# Altium project BEAGLEBONEBLACK_REV A5B.PrjPcb (part 4 of 5)

## Sheet P07_DDR3 Memory.SchDoc
size 386 x 246 mm
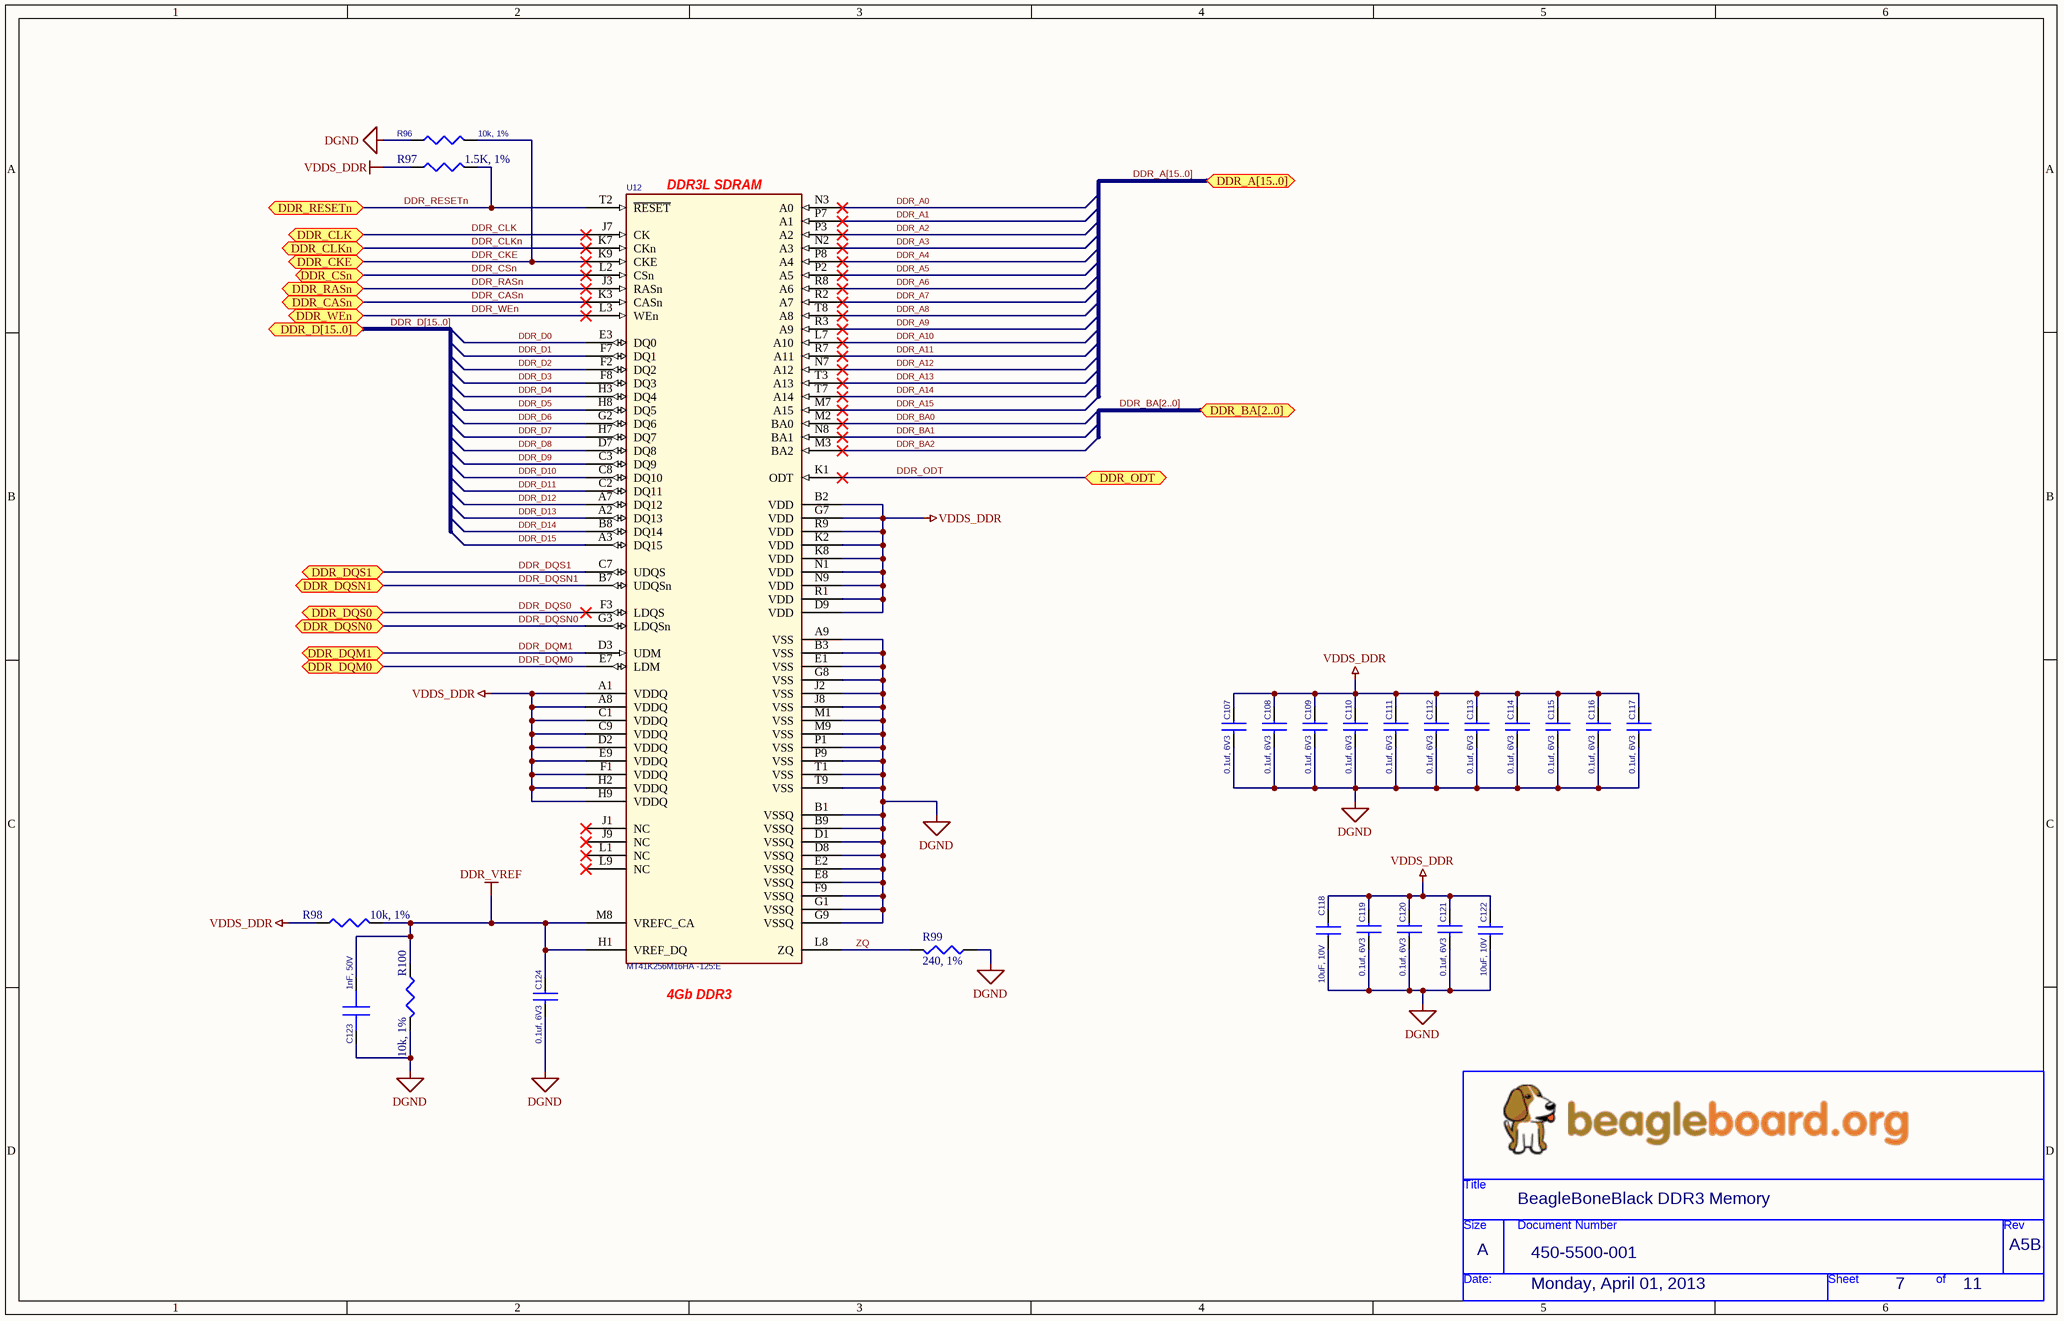
[diagram p8: P07_DDR3 Memory.SchDoc]

### Parts
(Parts that share a designator on the sheet are numbered #1, #2 ... from top to bottom, then left to right.)
*#7  Page Create Date: Monday, April 01, 2013  Doc: 450-5500-001  RevCode: A5B  Title: BeagleBoneBlack DDR3 Memory  Page Size: A  Page Number: 7  Page Count: 11  (hidden comment: BeagleBoard_org)  (graphical)
C107  0.1uf, 6V3  [402]
C108  0.1uf, 6V3  [402]
C109  0.1uf, 6V3  [402]
C110  0.1uf, 6V3  [402]
C111  0.1uf, 6V3  [402]
C112  0.1uf, 6V3  [402]
C113  0.1uf, 6V3  [402]
C114  0.1uf, 6V3  [402]
C115  0.1uf, 6V3  [402]
C116  0.1uf, 6V3  [402]
C117  0.1uf, 6V3  [402]
C118  10uF, 10V  [805]
C119  0.1uf, 6V3  [402]
C120  0.1uf, 6V3  [402]
C121  0.1uf, 6V3  [402]
C122  10uF, 10V  [805]
C123  1nF, 50V  [402]
C124  0.1uf, 6V3  [402]
R96  10k, 1%  [402]
R97  1.5K, 1%  [402]
R98  10k, 1%  [402]
R99  240, 1%  [402]
R100  10k, 1%  [402]
U12  MT41K256M16HA -125:E  [BGA96_T9_P8_9X14]

### Ports
DDR_A[15..0], DDR_BA[2..0], DDR_CASn, DDR_CKE, DDR_CLK, DDR_CLKn, DDR_CSn, DDR_D[15..0], DDR_DQM0, DDR_DQM1, DDR_DQS0, DDR_DQS1, DDR_DQSN0, DDR_DQSN1, DDR_ODT, DDR_RASn, DDR_RESETn, DDR_WEn

### Nets
DDR_VREF: C123.1 C124.1 R98.2 R100.1 U12.H1(VREF_DQ) U12.M8(VREFC_CA)
DGND: C107.2 C108.2 C109.2 C110.2 C111.2 C112.2 C113.2 C114.2 C115.2 C116.2 C117.2 C118.1 C119.2 C120.2 C121.2 C122.1 C123.2 C124.2 R96.1 R99.1 R100.2 U12.A9(VSS) U12.B1(VSSQ) U12.B3(VSS) U12.B9(VSSQ) U12.D1(VSSQ) U12.D8(VSSQ) U12.E1(VSS) U12.E2(VSSQ) U12.E8(VSSQ) U12.F9(VSSQ) U12.G1(VSSQ) U12.G8(VSS) U12.G9(VSSQ) U12.J2(VSS) U12.J8(VSS) U12.M1(VSS) U12.M9(VSS) U12.P1(VSS) U12.P9(VSS) U12.T1(VSS) U12.T9(VSS)
VDDS_DDR: C107.1 C108.1 C109.1 C110.1 C111.1 C112.1 C113.1 C114.1 C115.1 C116.1 C117.1 C118.2 C119.1 C120.1 C121.1 C122.2 R97.1 R98.1 U12.A1(VDDQ) U12.A8(VDDQ) U12.B2(VDD) U12.C1(VDDQ) U12.C9(VDDQ) U12.D2(VDDQ) U12.D9(VDD) U12.E9(VDDQ) U12.F1(VDDQ) U12.G7(VDD) U12.H2(VDDQ) U12.H9(VDDQ) U12.K2(VDD) U12.K8(VDD) U12.N1(VDD) U12.N9(VDD) U12.R1(VDD) U12.R9(VDD)
DDR_A0: U12.N3(A0)
DDR_A1: U12.P7(A1)
DDR_A2: U12.P3(A2)
DDR_A3: U12.N2(A3)
DDR_A4: U12.P8(A4)
DDR_A5: U12.P2(A5)
DDR_A6: U12.R8(A6)
DDR_A7: U12.R2(A7)
DDR_A8: U12.T8(A8)
DDR_A9: U12.R3(A9)
DDR_A10: U12.L7(A10)
DDR_A11: U12.R7(A11)
DDR_A12: U12.N7(A12)
DDR_A13: U12.T3(A13)
DDR_A14: U12.T7(A14)
DDR_A15: U12.M7(A15)
DDR_BA0: U12.M2(BA0)
DDR_BA1: U12.N8(BA1)
DDR_BA2: U12.M3(BA2)
DDR_CASn: U12.K3(CASn) ; port DDR_CASn
DDR_CKE: R96.2 U12.K9(CKE) ; port DDR_CKE
DDR_CLK: U12.J7(CK) ; port DDR_CLK
DDR_CLKn: U12.K7(CKn) ; port DDR_CLKn
DDR_CSn: U12.L2(CSn) ; port DDR_CSn
DDR_D0: U12.E3(DQ0)
DDR_D1: U12.F7(DQ1)
DDR_D2: U12.F2(DQ2)
DDR_D3: U12.F8(DQ3)
DDR_D4: U12.H3(DQ4)
DDR_D5: U12.H8(DQ5)
DDR_D6: U12.G2(DQ6)
DDR_D7: U12.H7(DQ7)
DDR_D8: U12.D7(DQ8)
DDR_D9: U12.C3(DQ9)
DDR_D10: U12.C8(DQ10)
DDR_D11: U12.C2(DQ11)
DDR_D12: U12.A7(DQ12)
DDR_D13: U12.A2(DQ13)
DDR_D14: U12.B8(DQ14)
DDR_D15: U12.A3(DQ15)
DDR_DQM0: U12.E7(LDM) ; port DDR_DQM0
DDR_DQM1: U12.D3(UDM) ; port DDR_DQM1
DDR_DQS0: U12.F3(LDQS) ; port DDR_DQS0
DDR_DQS1: U12.C7(UDQS) ; port DDR_DQS1
DDR_DQSN0: U12.G3(LDQSn) ; port DDR_DQSN0
DDR_DQSN1: U12.B7(UDQSn) ; port DDR_DQSN1
DDR_ODT: U12.K1(ODT) ; port DDR_ODT
DDR_RASn: U12.J3(RASn) ; port DDR_RASn
DDR_RESETn: R97.2 U12.T2(~{RESET}) ; port DDR_RESETn
DDR_WEn: U12.L3(WEn) ; port DDR_WEn
ZQ: R99.2 U12.L8(ZQ)

Not connected (* = marked no-connect by the designer): U12 J1(NC)* J9(NC)* L1(NC)* L9(NC)*

### Buses and harness runs
bus DDR_A[15..0] = port DDR_A[15..0]
bus DDR_BA[2..0] = port DDR_BA[2..0]
bus DDR_D[15..0] = port DDR_D[15..0]

### Notes on the sheet
- (near U12) DDR3L SDRAM
- (near U12) 4Gb DDR3
- (in symbol BeagleBoard_org) Title; Size; Document Number; Rev; Date:; Sheet; of

### Library data of the parts
C107-C117 C119-C121 C124 = CAP_0.01uf_X7R_16V_10%_0402: CAP CER 0.1UF 6.3V 10% X5R 0402; Manufacturer: TDK Corporation; Manufacturer Part Number: C1005X5R0J104K050BA; Capacitance: 0.1µF; Supplier 1: Digi-Key; Supplier Part Number 1: 445-1266-6-ND; RoHS: RoHS Compliant; Category: Capacitors; Stock 1: 127604; Pricing 1: 1=0.1, 10=0.026, 100=0.0121, 250=0.00992, 500=0.00848, 1000=0.0066, 5000=0.0055 (USD); Voltage - Rated: 6.3V; Tolerance: ±10%; Temperature Coefficient: X5R; Mounting Type: Surface Mount, MLCC; Operating Temperature: -55°C ~ 85°C; Applications: General Purpose; Ratings: -; Package / Case: 0402 (1005 Metric); Size / Dimension: 0.039" L x 0.020" W (1.00mm x 0.50mm); Height - Seated (Max): -; Thickness (Max): 0.022" (0.55mm); Lead Spacing: -; Features: -; Packaging: Digi-Reel®; Lead Style: -; ComponentLink1URL: http://www.kemet.com/datasheets&C0402C104K4RACTU; ComponentLink1Description: http://www.kemet.com/datasheets&C0402C104K4RACTU
C118 C122 = CAP_4.7uF_X5R_6.3V_10%_0603: CAP CER 10UF 10V Y5V 0805; Manufacturer: TDK Corporation; Manufacturer Part Number: C2012Y5V1A106Z; Capacitance: 10µF; Tolerance: -20%, +80%; Temperature Coefficient: Y5V (F); Supplier 1: Digi-Key; Supplier Part Number 1: 445-1371-6-ND; RoHS: RoHS Compliant; Category: Capacitors; Stock 1: 102071; Pricing 1: 1=0.15, 10=0.105, 100=0.0499, 250=0.042, 500=0.03518, 1000=0.02887 (USD); Voltage - Rated: 10V; Mounting Type: Surface Mount, MLCC; Operating Temperature: -30°C ~ 85°C; Applications: General Purpose; Ratings: -; Package / Case: 0805 (2012 Metric); Size / Dimension: 0.079" L x 0.049" W (2.00mm x 1.25mm); Height - Seated (Max): -; Thickness (Max): 0.057" (1.45mm); Lead Spacing: -; Features: -; Packaging: Digi-Reel®; Lead Style: -; ComponentLink1URL: http://media.digikey.com/pdf/Data%20Sheets/TDK%20PDFs/C_Series_GeneralAppl_B11.pdf; ComponentLink1Description: http://media.digikey.com/pdf/Data%20Sheets/TDK%20PDFs/C_Series_GeneralAppl_B11.pdf
C123 = CAP SMD: CAP CER 1000PF 16V 10% X7R 0402; Manufacturer: Yageo; Manufacturer Part Number: CC0402KRX7R7BB102; Supplier 1: Digi-Key; Supplier Part Number 1: 311-1352-6-ND; RoHS: RoHS Compliant; Category: Capacitors; Stock 1: 391222; Pricing 1: 1=0.1, 10=0.012, 25=0.0088, 100=0.0057, 250=0.00464, 500=0.00396, 1000=0.00309, 2500=0.00278, 5000=0.00258 (USD); Capacitance: 1000pF; Voltage - Rated: 16V; Tolerance: ±10%; Temperature Coefficient: X7R; Mounting Type: Surface Mount, MLCC; Operating Temperature: -55°C ~ 125°C; Applications: General Purpose; Ratings: -; Package / Case: 0402 (1005 Metric); Size / Dimension: 0.039" L x 0.020" W (1.00mm x 0.50mm); Height - Seated (Max): -; Thickness (Max): 0.022" (0.55mm); Lead Spacing: -; Features: -; Packaging: Digi-Reel®; Lead Style: -; ComponentLink1URL: http://www.yageo.com/documents/recent/UPY-GPHC_X7R_6.3V-to-50V_8.pdf; ComponentLink1Description: http://www.yageo.com/documents/recent/UPY-GPHC_X7R_6.3V-to-50V_8.pdf
R96 R98 R100 = RES_10K_1/16W_1%_0402: RES 10K OHM 1/16W 5% 0402 SMD; Manufacturer: Rohm Semiconductor; Manufacturer Part Number: MCR01MZPJ103; Power (Watts): 0.063W, 1/16W; Temperature Coefficient: ±200ppm/°C; Category: Resistors; ComponentLink1Description: http://rohmfs.rohm.com/en/products/databook/datasheet/passive/resistor/chip_resistor/mcr_a.pdf; ComponentLink1URL: http://rohmfs.rohm.com/en/products/databook/datasheet/passive/resistor/chip_resistor/mcr_a.pdf; Composition: Thick Film; Features: Automotive AEC-Q200 Qualified; Height: 0.016" (0.40mm); Number of Terminations: 2; Package / Case: 0402 (1005 Metric); Packaging: Digi-Reel®; Pricing 1: 1=0.1, 10=0.019, 25=0.014, 100=0.0078, 250=0.00596, 500=0.00476, 1000=0.0035, 5000=0.00251 (USD); Resistance (Ohms): 10k; RoHS: RoHS Compliant; Size / Dimension: 0.039" L x 0.020" W (1.00mm x 0.50mm); Stock 1: 110842; Supplier 1: Digi-Key; Supplier Device Package: 0402 (1005 Metric); Supplier Part Number 1: RHM10KJDKR-ND; Tolerance: ±5%
R97 = RES_10K_1/16W_1%_0402: RES 1.50K OHM 1/16W 1% 0402 SMD; Manufacturer: Yageo; Manufacturer Part Number: RC0402FR-071K5L; Power (Watts): 0.063W, 1/16W; Temperature Coefficient: ±100ppm/°C; Supplier 1: Digi-Key; Supplier Part Number 1: 311-1.50KLRDKR-ND; RoHS: RoHS Compliant; Category: Resistors; Stock 1: 433921; Pricing 1: 1=0.1, 10=0.014, 25=0.0104, 100=0.0063, 250=0.0054, 500=0.00382, 1000=0.0027, 2500=0.00234, 5000=0.00203 (USD); Resistance (Ohms): 1.5k; Composition: Thick Film; Features: -; Tolerance: ±1%; Package / Case: 0402 (1005 Metric); Supplier Device Package: 0402; Size / Dimension: 0.039" L x 0.020" W (1.00mm x 0.50mm); Height: 0.016" (0.40mm); Number of Terminations: 2; Packaging: Digi-Reel®; ComponentLink1URL: http://www.yageo.com/documents/recent/PYu-RC0402_51_RoHS_L_6.pdf; ComponentLink1Description: http://www.yageo.com/documents/recent/PYu-RC0402_51_RoHS_L_6.pdf
R99 = RES_10K_1/16W_1%_0402: RES 240 OHM 1/10W 5% 0402 SMD; Manufacturer: Yageo; Manufacturer Part Number: RC0402FR-07240RL; Resistance (Ohms): 240; Power (Watts): 0.063W, 1/16W; Temperature Coefficient: ±100ppm/°C; Supplier 1: Digi-Key; Supplier Part Number 1: 311-240LRDKR-ND; RoHS: RoHS Compliant; Category: Resistors; Stock 1: 39100; Pricing 1: 1=0.1, 10=0.014, 25=0.0104, 100=0.0063, 250=0.0054, 500=0.00382, 1000=0.0027, 2500=0.00234, 5000=0.00203 (USD); Composition: Thick Film; Features: -; Tolerance: ±1%; Package / Case: 0402 (1005 Metric); Supplier Device Package: 0402; Size / Dimension: 0.039" L x 0.020" W (1.00mm x 0.50mm); Height: 0.016" (0.40mm); Number of Terminations: 2; Packaging: Digi-Reel®; ComponentLink1URL: http://www.yageo.com/documents/recent/PYu-RC0402_51_RoHS_L_6.pdf; ComponentLink1Description: http://www.yageo.com/documents/recent/PYu-RC0402_51_RoHS_L_6.pdf
U12 = MT41K256M16HA: DDR2 SDRAM 2Gb (256Mx8); Manufacturer: Micron Technology; Lead Time: 0 weeks; Peak Solder Temperature: 260 deg C; Supplier 1: Arrow; Supplier Part Number 1: 52128708S9959891N2406; Manufacturer Part Number: MT41K256M16HA-125:E; RoHS: CHINA ROHS: Compliant / EU ROHS: Compliant; Stock 1: 0; Pricing 1: 0=10.09 (USD); Package Quantity: 1; Termination Finish: Sn/Ag/Cu; China ROHS Lead (X -> above / O -> below threshold): O; China ROHS Mercury (X -> above / O -> below threshold): O; China ROHS Cadmium (X -> above / O -> below threshold): O; China ROHS Hex Chromium (X -> above / O -> below threshold): O; China ROHS PBB (X -> above / O -> below threshold): O; China ROHS PBDE (X -> above / O -> below threshold): O; EU_ROHS_PROD_EXEMPTION_BY_SUPP: N/R; ComponentLink1URL: http://components.arrow.com/partservice/dataview/altium/52128708S9959891N2406?apiKey=aa438727d59eed98c4bed826d8d949c84cb5e685b92bf87346a0226bd2658797; ComponentLink1Description: http://components.arrow.com/partservice/dataview/altium/52128708S9959891N2406?apiKey=aa438727d59eed98c4bed826d8d949c84cb5e685b92bf87346a0226bd2658797

## Sheet P08_eMMC.SchDoc
size 386 x 246 mm
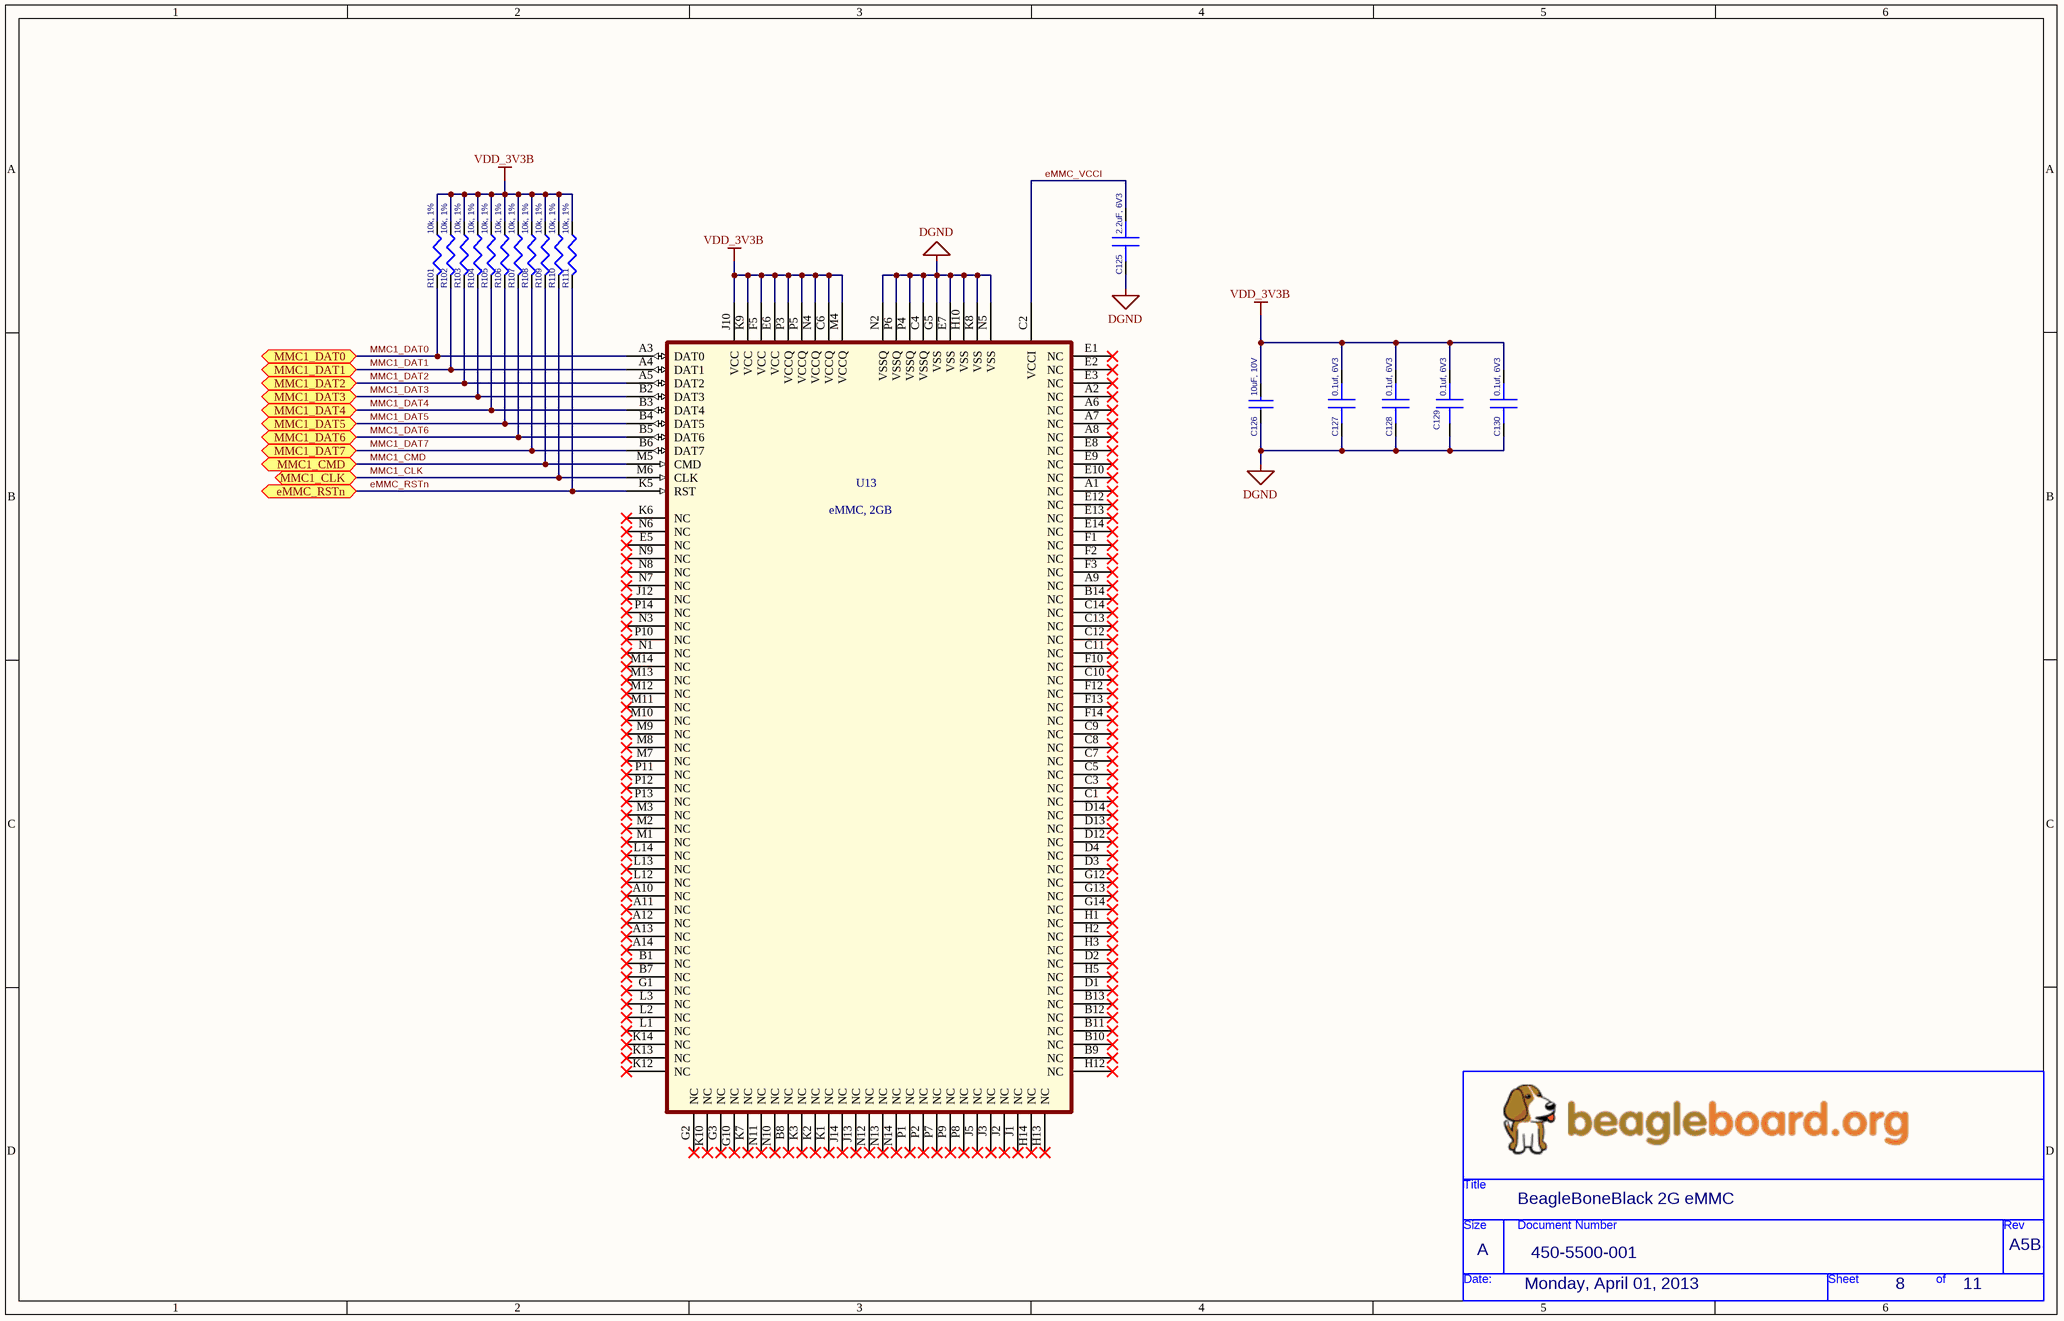
[diagram p9: P08_eMMC.SchDoc]

### Parts
(Parts that share a designator on the sheet are numbered #1, #2 ... from top to bottom, then left to right.)
*#8  Page Create Date: Monday, April 01, 2013  Doc: 450-5500-001  RevCode: A5B  Title: BeagleBoneBlack 2G eMMC  Page Size: A  Page Number: 8  Page Count: 11  (hidden comment: BeagleBoard_org)  (graphical)
C125  2.2uF, 6V3  [402]
C126  10uF, 10V  [805]
C127  0.1uf, 6V3  [402]
C128  0.1uf, 6V3  [402]
C129  0.1uf, 6V3  [402]
C130  0.1uf, 6V3  [402]
R101  10k, 1%  [402]
R102  10k, 1%  [402]
R103  10k, 1%  [402]
R104  10k, 1%  [402]
R105  10k, 1%  [402]
R106  10k, 1%  [402]
R107  10k, 1%  [402]
R108  10k, 1%  [402]
R109  10k, 1%  [402]
R110  10k, 1%  [402]
R111  10k, 1%  [402]
U13  eMMC, 2GB  [BGA153_P14_P5_11P5X13]

### Ports
eMMC_RSTn, MMC1_CLK, MMC1_CMD, MMC1_DAT0, MMC1_DAT1, MMC1_DAT2, MMC1_DAT3, MMC1_DAT4, MMC1_DAT5, MMC1_DAT6, MMC1_DAT7

### Nets
DGND: C125.2 C126.1 C127.2 C128.2 C129.2 C130.2 U13.C4(VSSQ) U13.E7(VSS) U13.G5(VSS) U13.H10(VSS) U13.K8(VSS) U13.N2(VSSQ) U13.N5(VSS) U13.P4(VSSQ) U13.P6(VSSQ)
VDD_3V3B: C126.2 C127.1 C128.1 C129.1 C130.1 R101.1 R102.1 R103.1 R104.1 R105.1 R106.1 R107.1 R108.1 R109.1 R110.1 R111.1 U13.C6(VCCQ) U13.E6(VCC) U13.F5(VCC) U13.J10(VCC) U13.K9(VCC) U13.M4(VCCQ) U13.N4(VCCQ) U13.P3(VCCQ) U13.P5(VCCQ)
eMMC_RSTn: R111.2 U13.K5(RST) ; port eMMC_RSTn
eMMC_VCCI: C125.1 U13.C2(VCCI)
MMC1_CLK: R110.2 U13.M6(CLK) ; port MMC1_CLK
MMC1_CMD: R109.2 U13.M5(CMD) ; port MMC1_CMD
MMC1_DAT0: R101.2 U13.A3(DAT0) ; port MMC1_DAT0
MMC1_DAT1: R102.2 U13.A4(DAT1) ; port MMC1_DAT1
MMC1_DAT2: R103.2 U13.A5(DAT2) ; port MMC1_DAT2
MMC1_DAT3: R104.2 U13.B2(DAT3) ; port MMC1_DAT3
MMC1_DAT4: R105.2 U13.B3(DAT4) ; port MMC1_DAT4
MMC1_DAT5: R106.2 U13.B4(DAT5) ; port MMC1_DAT5
MMC1_DAT6: R107.2 U13.B5(DAT6) ; port MMC1_DAT6
MMC1_DAT7: R108.2 U13.B6(DAT7) ; port MMC1_DAT7

Not connected (* = marked no-connect by the designer): U13 A1(NC)* A2(NC)* A6(NC)* A7(NC)* A8(NC)* A9(NC)* A10(NC)* A11(NC)* A12(NC)* A13(NC)* A14(NC)* B1(NC)* B7(NC)* B8(NC)* B9(NC)* B10(NC)* B11(NC)* B12(NC)* B13(NC)* B14(NC)* C1(NC)* C3(NC)* C5(NC)* C7(NC)* C8(NC)* C9(NC)* C10(NC)* C11(NC)* C12(NC)* C13(NC)* C14(NC)* D1(NC)* D2(NC)* D3(NC)* D4(NC)* D12(NC)* D13(NC)* D14(NC)* E1(NC)* E2(NC)* E3(NC)* E5(NC)* E8(NC)* E9(NC)* E10(NC)* E12(NC)* E13(NC)* E14(NC)* F1(NC)* F2(NC)* F3(NC)* F10(NC)* F12(NC)* F13(NC)* F14(NC)* G1(NC)* G2(NC)* G3(NC)* G10(NC)* G12(NC)* G13(NC)* G14(NC)* H1(NC)* H2(NC)* H3(NC)* H5(NC)* H12(NC)* H13(NC)* H14(NC)* J1(NC)* J2(NC)* J3(NC)* J5(NC)* J12(NC)* J13(NC)* J14(NC)* K1(NC)* K2(NC)* K3(NC)* K6(NC)* K7(NC)* K10(NC)* K12(NC)* K13(NC)* K14(NC)* L1(NC)* L2(NC)* L3(NC)* L12(NC)* L13(NC)* L14(NC)* M1(NC)* M2(NC)* M3(NC)* M7(NC)* M8(NC)* M9(NC)* M10(NC)* M11(NC)* M12(NC)* M13(NC)* M14(NC)* N1(NC)* N3(NC)* N6(NC)* N7(NC)* N8(NC)* N9(NC)* N10(NC)* N11(NC)* N12(NC)* N13(NC)* N14(NC)* P1(NC)* P2(NC)* P7(NC)* P8(NC)* P9(NC)* P10(NC)* P11(NC)* P12(NC)* P13(NC)* P14(NC)*

### Notes on the sheet
- (in symbol BeagleBoard_org) Title; Size; Document Number; Rev; Date:; Sheet; of

### Library data of the parts
C125 = CAP SMD: CAP CER 2.2UF 6.3V 10% X5R 0402; Manufacturer: TDK Corporation; Manufacturer Part Number: C1005X5R0J225K050BC; Capacitance: 2.2µF; Supplier 1: Digi-Key; Supplier Part Number 1: 445-6847-6-ND; RoHS: RoHS Compliant; Category: Capacitors; Stock 1: 186346; Pricing 1: 1=0.24, 10=0.2, 100=0.1, 250=0.075, 500=0.06626, 1000=0.05875, 5000=0.04875 (USD); Voltage - Rated: 6.3V; Tolerance: ±10%; Temperature Coefficient: X5R; Mounting Type: Surface Mount, MLCC; Operating Temperature: -55°C ~ 85°C; Applications: General Purpose; Ratings: -; Package / Case: 0402 (1005 Metric); Size / Dimension: 0.039" L x 0.020" W (1.00mm x 0.50mm); Height - Seated (Max): -; Thickness (Max): 0.022" (0.55mm); Lead Spacing: -; Features: -; Packaging: Digi-Reel®; Lead Style: -; ComponentLink1URL: http://product.tdk.com/capacitor/mlcc/en/documents/mlcc_commercial_general_en.pdf; ComponentLink1Description: http://product.tdk.com/capacitor/mlcc/en/documents/mlcc_commercial_general_en.pdf
C126 = CAP_4.7uF_X5R_6.3V_10%_0603: as C118 on sheet P07_DDR3 Memory; Supplier 1: Digi-Key; Supplier Part Number 1: 445-1371-6-ND; RoHS: RoHS Compliant; Category: Capacitors; Stock 1: 102071; Pricing 1: 1=0.15, 10=0.105, 100=0.0499, 250=0.042, 500=0.03518, 1000=0.02887 (USD); Voltage - Rated: 10V; Mounting Type: Surface Mount, MLCC; Operating Temperature: -30°C ~ 85°C; Applications: General Purpose; Ratings: -; Package / Case: 0805 (2012 Metric); Size / Dimension: 0.079" L x 0.049" W (2.00mm x 1.25mm); Height - Seated (Max): -; Thickness (Max): 0.057" (1.45mm); Lead Spacing: -; Features: -; Packaging: Digi-Reel®; Lead Style: -; ComponentLink1URL: http://media.digikey.com/pdf/Data%20Sheets/TDK%20PDFs/C_Series_GeneralAppl_B11.pdf; ComponentLink1Description: http://media.digikey.com/pdf/Data%20Sheets/TDK%20PDFs/C_Series_GeneralAppl_B11.pdf
C127-C130 = CAP SMD: CAP CER 0.1UF 6.3V 10% X5R 0402; Manufacturer: TDK Corporation; Manufacturer Part Number: C1005X5R0J104K050BA; Capacitance: 0.1µF; Supplier 1: Digi-Key; Supplier Part Number 1: 445-1266-6-ND; RoHS: RoHS Compliant; Category: Capacitors; Stock 1: 127604; Pricing 1: 1=0.1, 10=0.026, 100=0.0121, 250=0.00992, 500=0.00848, 1000=0.0066, 5000=0.0055 (USD); Voltage - Rated: 6.3V; Tolerance: ±10%; Temperature Coefficient: X5R; Mounting Type: Surface Mount, MLCC; Operating Temperature: -55°C ~ 85°C; Applications: General Purpose; Ratings: -; Package / Case: 0402 (1005 Metric); Size / Dimension: 0.039" L x 0.020" W (1.00mm x 0.50mm); Height - Seated (Max): -; Thickness (Max): 0.022" (0.55mm); Lead Spacing: -; Features: -; Packaging: Digi-Reel®; Lead Style: -; ComponentLink1URL: http://product.tdk.com/capacitor/mlcc/en/documents/mlcc_commercial_general_en.pdf; ComponentLink1Description: http://product.tdk.com/capacitor/mlcc/en/documents/mlcc_commercial_general_en.pdf
R101-R111 = RES_10K_1/16W_1%_0402: as R96 on sheet P07_DDR3 Memory; Category: Resistors; ComponentLink1Description: http://rohmfs.rohm.com/en/products/databook/datasheet/passive/resistor/chip_resistor/mcr_a.pdf; ComponentLink1URL: http://rohmfs.rohm.com/en/products/databook/datasheet/passive/resistor/chip_resistor/mcr_a.pdf; Composition: Thick Film; Features: Automotive AEC-Q200 Qualified; Height: 0.016" (0.40mm); Number of Terminations: 2; Package / Case: 0402 (1005 Metric); Packaging: Digi-Reel®; Pricing 1: 1=0.1, 10=0.019, 25=0.014, 100=0.0078, 250=0.00596, 500=0.00476, 1000=0.0035, 5000=0.00251 (USD); Resistance (Ohms): 10k; RoHS: RoHS Compliant; Size / Dimension: 0.039" L x 0.020" W (1.00mm x 0.50mm); Stock 1: 110842; Supplier 1: Digi-Key; Supplier Device Package: 0402 (1005 Metric); Supplier Part Number 1: RHM10KJDKR-ND; Tolerance: ±5%
U13 = eMMC: Flash Card 2G-byte 3.3V MultiMedia Card 153-Pin WFBGA; Manufacturer: Micron Technology; Manufacturer Part Number: MTFC2GMVEA-0M WT; Lead Time: 2 weeks; Supplier 1: Arrow; Supplier Part Number 1: 53710993S251949N2406; RoHS: CHINA ROHS: Compliant / EU ROHS: Compliant; Stock 1: 1009; Pricing 1: 0=7.21 (USD); Package Quantity: 1; EU_ROHS_PROD_EXEMPTION_BY_SUPP: N/R; ComponentLink1URL: http://components.arrow.com/partservice/dataview/altium/53710993S251949N2406?apiKey=aa438727d59eed98c4bed826d8d949c84cb5e685b92bf87346a0226bd2658797; ComponentLink1Description: http://components.arrow.com/partservice/dataview/altium/53710993S251949N2406?apiKey=aa438727d59eed98c4bed826d8d949c84cb5e685b92bf87346a0226bd2658797

## Sheet P09_Ethernet.SchDoc
size 513 x 386 mm
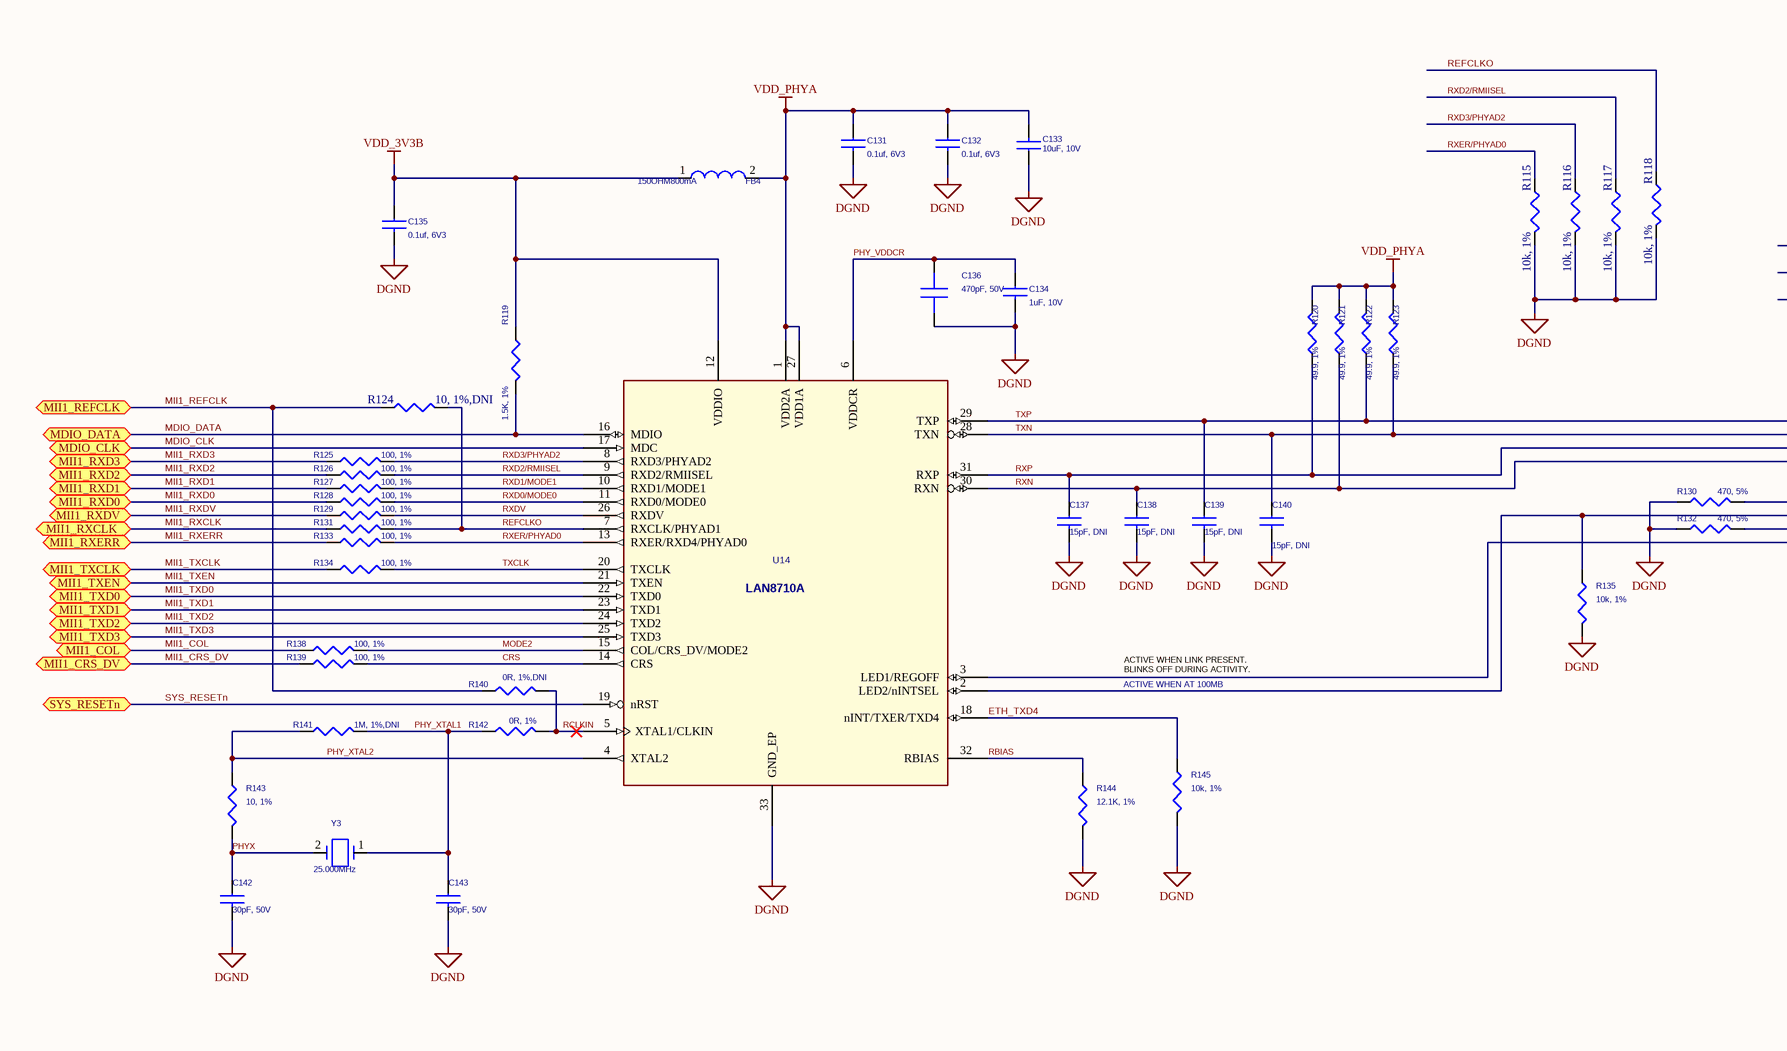
[diagram p10: P09_Ethernet.SchDoc, left]
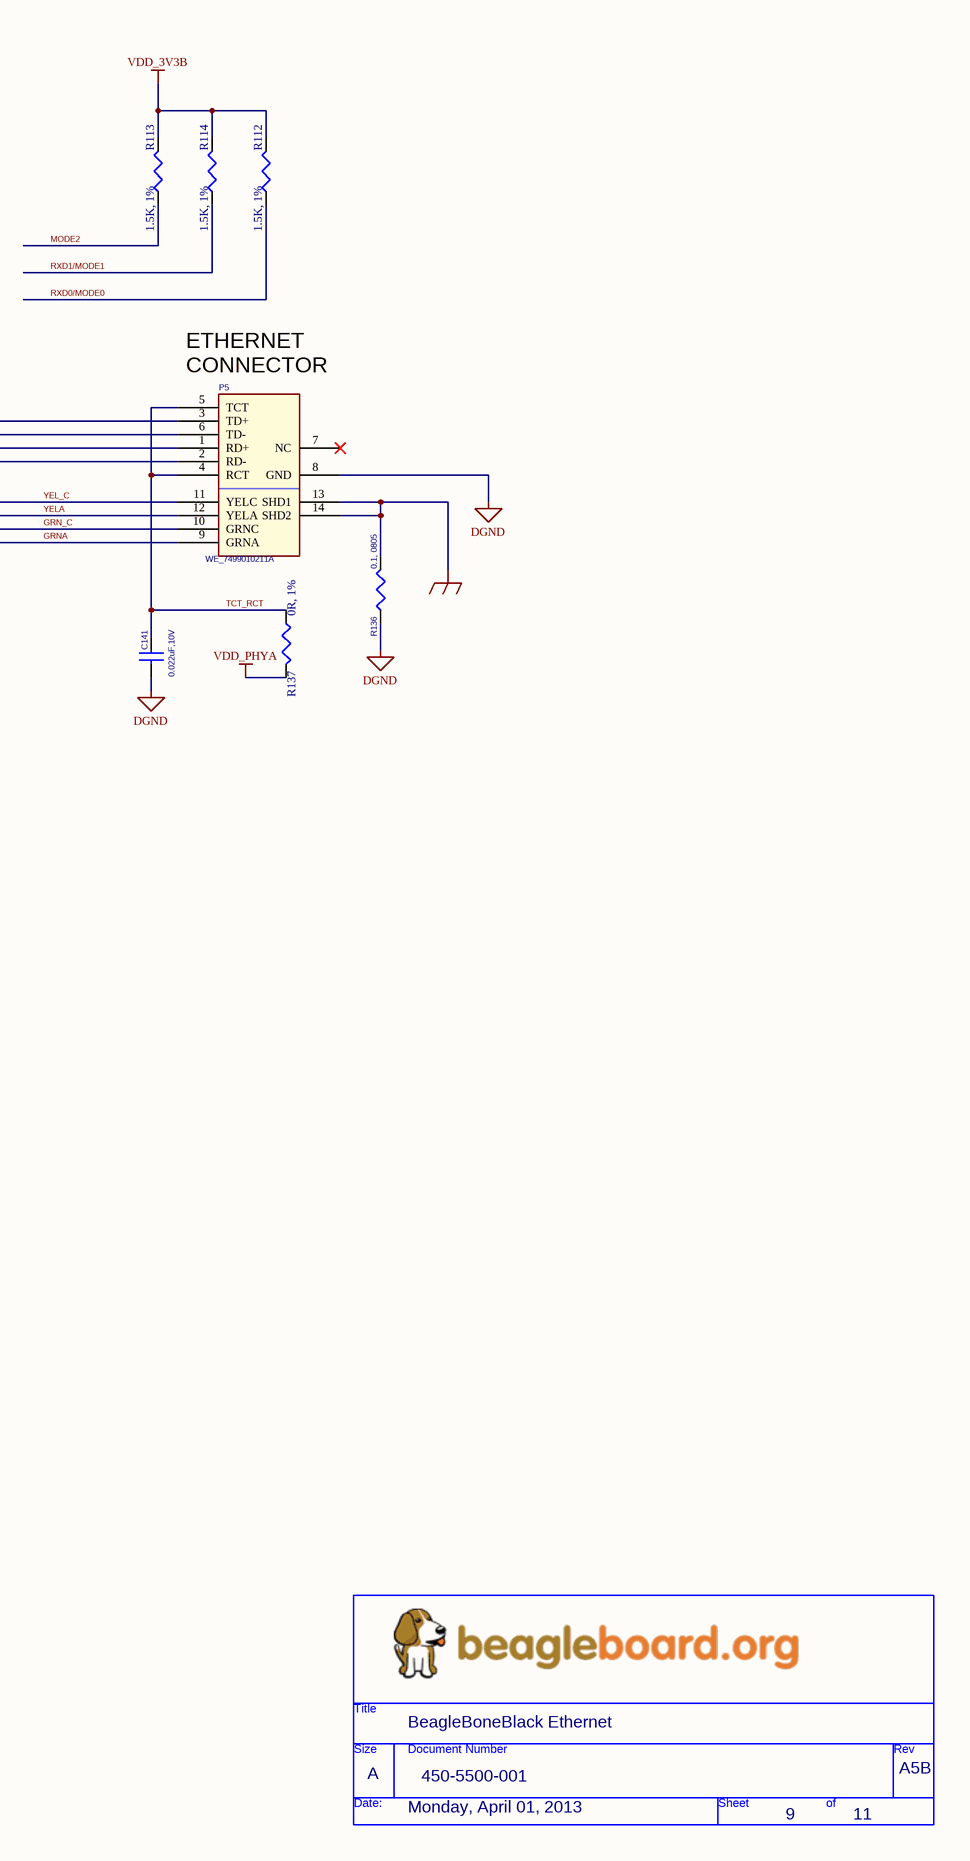
[diagram p11: P09_Ethernet.SchDoc, right]

### Parts
(Parts that share a designator on the sheet are numbered #1, #2 ... from top to bottom, then left to right.)
*#9  Page Create Date: Monday, April 01, 2013  Doc: 450-5500-001  RevCode: A5B  Title: BeagleBoneBlack Ethernet  Page Size: A  Page Number: 9  Page Count: 11  (hidden comment: BeagleBoard_org)  (graphical)
C131  0.1uf, 6V3  [402]
C132  0.1uf, 6V3  [402]
C133  10uF, 10V  [805]
C134  1uF, 10V  [402]
C135  0.1uf, 6V3  [402]
C136  470pF, 50V  [402]
C137  15pF, DNI  [402]
C138  15pF, DNI  [402]
C139  15pF, DNI  [402]
C140  15pF, DNI  [402]
C141  0.022uF,10V  [402]
C142  30pF, 50V  [402]
C143  30pF, 50V  [402]
FB4  150OHM800mA  [SM-7351-IND-0805]
P5  WE_7499010211A  [RJ45-7499010211A]
R112  1.5K, 1%  [402]
R113  1.5K, 1%  [402]
R114  1.5K, 1%  [402]
R115  10k, 1%  [402]
R116  10k, 1%  [402]
R117  10k, 1%  [402]
R118  10k, 1%  [402]
R119  1.5K, 1%  [402]
R120  49.9, 1%  [402]
R121  49.9, 1%  [402]
R122  49.9, 1%  [402]
R123  49.9, 1%  [402]
R124  10, 1%,DNI  [402]
R125  100, 1%  [402]
R126  100, 1%  [402]
R127  100, 1%  [402]
R128  100, 1%  [402]
R129  100, 1%  [402]
R130  470, 5%  [402]
R131  100, 1%  [402]
R132  470, 5%  [402]
R133  100, 1%  [402]
R134  100, 1%  [402]
R135  10k, 1%  [402]
R136  0.1, 0805  [805]
R137  0R, 1%  [402]
R138  100, 1%  [402]
R139  100, 1%  [402]
R140  0R, 1%,DNI  [402]
R141  1M, 1%,DNI  [402]
R142  0R, 1%  [402]
R143  10, 1%  [402]
R144  12.1K, 1%  [402]
R145  10k, 1%  [402]
U14  LAN8710A  [QFN32_5X5MM_EP3P3MM]
Y3  25.000MHz  [XTAL150SMD_125X196]

### Ports
MDIO_CLK, MDIO_DATA, MII1_COL, MII1_CRS_DV, MII1_REFCLK, MII1_RXCLK, MII1_RXD0, MII1_RXD1, MII1_RXD2, MII1_RXD3, MII1_RXDV, MII1_RXERR, MII1_TXCLK, MII1_TXD0, MII1_TXD1, MII1_TXD2, MII1_TXD3, MII1_TXEN, SYS_RESETn

### Nets
DGND: C131.2 C132.2 C133.1 C134.2 C135.2 C136.2 C137.2 C138.2 C139.2 C140.2 C141.2 C142.2 C143.2 P5.8(GND) R115.2 R116.2 R117.2 R118.2 R130.1 R132.1 R135.2 R136.1 R144.2 R145.2 U14.33(GND_EP)
GND_EARTH: P5.13(SHD1) P5.14(SHD2) R136.2
VDD_3V3B: C135.1 FB4.1 R112.2 R113.2 R114.2 R119.1 U14.12(VDDIO)
VDD_PHYA: C131.1 C132.1 C133.2 FB4.2 R120.2 R121.2 R122.2 R123.2 R137.2 U14.1(VDD2A) U14.27(VDD1A)
CRS: R139.2 U14.14(CRS)
ETH_TXD4: R145.1 U14.18(nINT/TXER/TXD4)
GRN_C: P5.10(GRNC) R132.2
GRNA: P5.9(GRNA) U14.3(LED1/REGOFF)
MDIO_CLK: U14.17(MDC) ; port MDIO_CLK
MDIO_DATA: R119.2 U14.16(MDIO) ; port MDIO_DATA
MII1_COL: R138.1 ; port MII1_COL
MII1_CRS_DV: R139.1 ; port MII1_CRS_DV
MII1_REFCLK: R124.1 R140.1 ; port MII1_REFCLK
MII1_RXCLK: R131.1 ; port MII1_RXCLK
MII1_RXD0: R128.1 ; port MII1_RXD0
MII1_RXD1: R127.1 ; port MII1_RXD1
MII1_RXD2: R126.1 ; port MII1_RXD2
MII1_RXD3: R125.1 ; port MII1_RXD3
MII1_RXDV: R129.1 ; port MII1_RXDV
MII1_RXERR: R133.1 ; port MII1_RXERR
MII1_TXCLK: R134.1 ; port MII1_TXCLK
MII1_TXD0: U14.22(TXD0) ; port MII1_TXD0
MII1_TXD1: U14.23(TXD1) ; port MII1_TXD1
MII1_TXD2: U14.24(TXD2) ; port MII1_TXD2
MII1_TXD3: U14.25(TXD3) ; port MII1_TXD3
MII1_TXEN: U14.21(TXEN) ; port MII1_TXEN
MODE2: R113.1 R138.2 U14.15(COL/CRS_DV/MODE2)
PHY_VDDCR: C134.1 C136.1 U14.6(VDDCR)
PHY_XTAL1: C143.1 R141.2 R142.1 Y3.1
PHY_XTAL2: R141.1 R143.1 U14.4(XTAL2)
PHYX: C142.1 R143.2 Y3.2
RBIAS: R144.1 U14.32(RBIAS)
RCLKIN: R140.2 R142.2 U14.5(XTAL1/CLKIN)
REFCLKO: R118.1 R124.2 R131.2 U14.7(RXCLK/PHYAD1)
RXD0/MODE0: R112.1 R128.2 U14.11(RXD0/MODE0)
RXD1/MODE1: R114.1 R127.2 U14.10(RXD1/MODE1)
RXD2/RMIISEL: R117.1 R126.2 U14.9(RXD2/RMIISEL)
RXD3/PHYAD2: R116.1 R125.2 U14.8(RXD3/PHYAD2)
RXDV: R129.2 U14.26(RXDV)
RXER/PHYAD0: R115.1 R133.2 U14.13(RXER/RXD4/PHYAD0)
RXN: C138.1 P5.2(RD-) R121.1 U14.30(RXN)
RXP: C137.1 P5.1(RD+) R120.1 U14.31(RXP)
SYS_RESETn: U14.19(nRST) ; port SYS_RESETn
TCT_RCT: C141.1 P5.4(RCT) P5.5(TCT) R137.1
TXCLK: R134.2 U14.20(TXCLK)
TXN: C140.1 P5.6(TD-) R123.1 U14.28(TXN)
TXP: C139.1 P5.3(TD+) R122.1 U14.29(TXP)
YEL_C: P5.11(YELC) R130.2
YELA: P5.12(YELA) R135.1 U14.2(LED2/nINTSEL)

Not connected (* = marked no-connect by the designer): P5 7(NC)*

### Notes on the sheet
- (near P5) ETHERNET
  CONNECTOR
- ACTIVE WHEN LINK PRESENT.
  BLINKS OFF DURING ACTIVITY.
- ACTIVE WHEN AT 100MB
- (in symbol BeagleBoard_org) Title; Size; Document Number; Rev; Date:; Sheet; of

### Library data of the parts
C131 C132 C135 = CAP_0.1uF_X7R_16V_10% 0402: CAP CER 0.1UF 6.3V 10% X5R 0402; Manufacturer: TDK Corporation; Manufacturer Part Number: C1005X5R0J104K050BA; Capacitance: 0.1µF; Supplier 1: Digi-Key; Supplier Part Number 1: 445-1266-6-ND; RoHS: RoHS Compliant; Category: Capacitors; Stock 1: 127604; Pricing 1: 1=0.1, 10=0.026, 100=0.0121, 250=0.00992, 500=0.00848, 1000=0.0066, 5000=0.0055 (USD); Voltage - Rated: 6.3V; Tolerance: ±10%; Temperature Coefficient: X5R; Mounting Type: Surface Mount, MLCC; Operating Temperature: -55°C ~ 85°C; Applications: General Purpose; Ratings: -; Package / Case: 0402 (1005 Metric); Size / Dimension: 0.039" L x 0.020" W (1.00mm x 0.50mm); Height - Seated (Max): -; Thickness (Max): 0.022" (0.55mm); Lead Spacing: -; Features: -; Packaging: Digi-Reel®; Lead Style: -; ComponentLink1URL: http://www.kemet.com/datasheets&C0402C104K4RACTU; ComponentLink1Description: http://www.kemet.com/datasheets&C0402C104K4RACTU
C133 = CAP_4.7uF_X5R_6.3V_10%_0603: as C118 on sheet P07_DDR3 Memory; Supplier 1: Digi-Key; Supplier Part Number 1: 445-1371-6-ND; RoHS: RoHS Compliant; Category: Capacitors; Stock 1: 102071; Pricing 1: 1=0.15, 10=0.105, 100=0.0499, 250=0.042, 500=0.03518, 1000=0.02887 (USD); Voltage - Rated: 10V; Mounting Type: Surface Mount, MLCC; Operating Temperature: -30°C ~ 85°C; Applications: General Purpose; Ratings: -; Package / Case: 0805 (2012 Metric); Size / Dimension: 0.079" L x 0.049" W (2.00mm x 1.25mm); Height - Seated (Max): -; Thickness (Max): 0.057" (1.45mm); Lead Spacing: -; Features: -; Packaging: Digi-Reel®; Lead Style: -; ComponentLink1URL: http://media.digikey.com/pdf/Data%20Sheets/TDK%20PDFs/C_Series_GeneralAppl_B11.pdf; ComponentLink1Description: http://media.digikey.com/pdf/Data%20Sheets/TDK%20PDFs/C_Series_GeneralAppl_B11.pdf
C134 = CAP_1.0UF_X5R_10V_10%_0402: CAP CER 1UF 10V 10% X5R 0402; Manufacturer: AVX Corporation; Manufacturer Part Number: 0402ZD105KAT2A; Capacitance: 1.0µF; Applications: General Purpose; Category: Capacitors; ComponentLink1Description: http://www.avx.com/docs/Catalogs/cx5r.pdf; ComponentLink1URL: http://www.avx.com/docs/Catalogs/cx5r.pdf; Features: -; Height - Seated (Max): -; Lead Spacing: -; Lead Style: -; Mounting Type: Surface Mount, MLCC; Operating Temperature: -55°C ~ 85°C; Package / Case: 0402 (1005 Metric); Packaging: Digi-Reel®; Pricing 1: 1=0.3, 10=0.25, 100=0.125, 250=0.09376, 500=0.08282, 1000=0.07344, 5000=0.06094 (USD); Ratings: -; RoHS: RoHS Compliant; Size / Dimension: 0.039" L x 0.020" W (1.00mm x 0.50mm); Stock 1: 409277; Supplier 1: Digi-Key; Supplier Part Number 1: 478-4596-6-ND; Temperature Coefficient: X5R; Thickness (Max): 0.022" (0.56mm); Tolerance: ±10%; Voltage - Rated: 10V
C136 = 470pF/5%/50V/C0G/0603_0: CAP CER 470PF 50V 10% X7R 0402; Manufacturer: Murata Electronics North America; Manufacturer Part Number: GRM155R71H471KA01D; Supplier 1: Digi-Key; Supplier Part Number 1: 490-1300-6-ND; RoHS: RoHS Compliant; Category: Capacitors; Stock 1: 211618; Pricing 1: 1=0.1, 10=0.025, 50=0.0136, 100=0.0116, 250=0.00944, 500=0.00808, 1000=0.0063, 5000=0.00525 (USD); Capacitance: 470pF; Voltage - Rated: 50V; Tolerance: ±10%; Temperature Coefficient: X7R; Mounting Type: Surface Mount, MLCC; Operating Temperature: -55°C ~ 125°C; Applications: General Purpose; Ratings: -; Package / Case: 0402 (1005 Metric); Size / Dimension: 0.039" L x 0.020" W (1.00mm x 0.50mm); Height - Seated (Max): -; Thickness (Max): 0.022" (0.55mm); Lead Spacing: -; Features: -; Packaging: Digi-Reel®; Lead Style: -; ComponentLink1URL: http://psearch.murata.com/capacitor/product/GRM155R71H471KA01#.pdf; ComponentLink1Description: http://psearch.murata.com/capacitor/product/GRM155R71H471KA01#.pdf
C137-C140 = CAP_0402_100pF_COG_50V: CAP CER 15PF 50V 5% NP0 0402; Manufacturer: TDK Corporation; Manufacturer Part Number: C1005C0G1H150J050BA; Temperature Coefficient: C0G, NP0; Supplier 1: Digi-Key; Supplier Part Number 1: 445-1237-6-ND; RoHS: RoHS Compliant; Category: Capacitors; Stock 1: 233335; Pricing 1: 1=0.1, 10=0.024, 100=0.011, 250=0.009, 500=0.0077, 1000=0.006, 5000=0.005 (USD); Capacitance: 15pF; Voltage - Rated: 50V; Tolerance: ±5%; Mounting Type: Surface Mount, MLCC; Operating Temperature: -55°C ~ 125°C; Applications: General Purpose; Ratings: -; Package / Case: 0402 (1005 Metric); Size / Dimension: 0.039" L x 0.020" W (1.00mm x 0.50mm); Height - Seated (Max): -; Thickness (Max): 0.022" (0.55mm); Lead Spacing: -; Features: -; Packaging: Digi-Reel®; Lead Style: -; ComponentLink1URL: http://product.tdk.com/capacitor/mlcc/en/documents/mlcc_commercial_general_en.pdf; ComponentLink1Description: http://product.tdk.com/capacitor/mlcc/en/documents/mlcc_commercial_general_en.pdf
C141 = CAP_0402_0.1uf_X5R_10V: CAP CER 0.022UF 10V 10% X7R 0402; Manufacturer: Taiyo Yuden; Manufacturer Part Number: LMK105B7223KV-F; Capacitance: 0.022µF; Supplier 1: Digi-Key; Supplier Part Number 1: 587-2476-6-ND; RoHS: RoHS Compliant; Category: Capacitors; Stock 1: 11748; Pricing 1: 1=0.1, 10=0.013, 50=0.0072, 100=0.0061, 250=0.00496, 500=0.00424, 1000=0.0033, 2500=0.00297, 5000=0.00275 (USD); Voltage - Rated: 10V; Tolerance: ±10%; Temperature Coefficient: X7R; Mounting Type: Surface Mount, MLCC; Operating Temperature: -55°C ~ 125°C; Applications: General Purpose; Ratings: -; Package / Case: 0402 (1005 Metric); Size / Dimension: 0.039" L x 0.020" W (1.00mm x 0.50mm); Height - Seated (Max): -; Thickness (Max): 0.022" (0.55mm); Lead Spacing: -; Features: -; Packaging: Digi-Reel®; Lead Style: -; ComponentLink1URL: http://www.yuden.co.jp/or/product/category/capacitor/LMK105B7223KV-F.pdf; ComponentLink1Description: http://www.yuden.co.jp/or/product/category/capacitor/LMK105B7223KV-F.pdf
C142 C143 = CAP_30PF_COG_50V_5%_0402: CAP CER 30PF 50V 5% NP0 0402; Manufacturer: TDK Corporation; Manufacturer Part Number: C1005C0G1H300J; Temperature Coefficient: C0G, NP0; Supplier 1: Digi-Key; Supplier Part Number 1: 445-4902-6-ND; RoHS: RoHS Compliant; Category: Capacitors; Stock 1: 120757; Pricing 1: 1=0.1, 10=0.026, 100=0.0121, 250=0.00992, 500=0.00848, 1000=0.0066, 5000=0.0055 (USD); Capacitance: 30pF; Voltage - Rated: 50V; Tolerance: ±5%; Mounting Type: Surface Mount, MLCC; Operating Temperature: -55°C ~ 125°C; Applications: General Purpose; Ratings: -; Package / Case: 0402 (1005 Metric); Size / Dimension: 0.039" L x 0.020" W (1.00mm x 0.50mm); Height - Seated (Max): -; Thickness (Max): 0.022" (0.55mm); Lead Spacing: -; Features: -; Packaging: Digi-Reel®; Lead Style: -; ComponentLink1URL: http://media.digikey.com/pdf/Data%20Sheets/TDK%20PDFs/C_Series_GeneralAppl_B11.pdf; ComponentLink1Description: http://media.digikey.com/pdf/Data%20Sheets/TDK%20PDFs/C_Series_GeneralAppl_B11.pdf
FB4 = FER_180_200_0: FERRITE 800MA 150 OHM 0805 SMD; PartName: FerriteBead150ohm800mA; Mfr: Steward; MfrNum: LI0805H151R-10; TIIntPartnumber: 1L0010; Manufacturer: Laird-Signal Integrity Products; Vendor: Digikey; DC Resistance (DCR): 150 mOhm Max; Filter Type: Differential Mode - Single; Impedance @ Frequency: 150 Ohm @ 100MHz; Category: Filters; ComponentLink1Description: http://www.lairdtech.com/WorkArea/linkit.aspx?LinkIdentifier=id&ItemID=4912; ComponentLink1URL: http://www.lairdtech.com/WorkArea/linkit.aspx?LinkIdentifier=id&ItemID=4912; Current Rating: 800mA; Height (Max): 0.043" (1.10mm); Manufacturer Part Number: LI0805H151R-10; Mounting Type: Surface Mount; Package / Case: 0805 (2012 Metric); Packaging: Digi-Reel®; Pricing 1: 1=0.1, 10=0.07, 25=0.064, 50=0.0574, 100=0.0421, 250=0.03064, 500=0.02808, 1000=0.02424 (USD); RoHS: RoHS Compliant; Size / Dimension: 0.079" L x 0.049" W (2.00mm x 1.25mm); Stock 1: 3694; Supplier 1: Digi-Key; Supplier Part Number 1: 240-2384-6-ND
P5 = CONN_RJ45_MAG_WE_0: WE-RJ45 LAN Transformer
R112-R114 = RES_10K_1/16W_1%_0402: as R97 on sheet P07_DDR3 Memory; Supplier 1: Digi-Key; Supplier Part Number 1: 311-1.50KLRDKR-ND; RoHS: RoHS Compliant; Category: Resistors; Stock 1: 433921; Pricing 1: 1=0.1, 10=0.014, 25=0.0104, 100=0.0063, 250=0.0054, 500=0.00382, 1000=0.0027, 2500=0.00234, 5000=0.00203 (USD); Resistance (Ohms): 1.5k; Composition: Thick Film; Features: -; Tolerance: ±1%; Package / Case: 0402 (1005 Metric); Supplier Device Package: 0402; Size / Dimension: 0.039" L x 0.020" W (1.00mm x 0.50mm); Height: 0.016" (0.40mm); Number of Terminations: 2; Packaging: Digi-Reel®; ComponentLink1URL: http://www.yageo.com/documents/recent/PYu-RC0402_51_RoHS_L_6.pdf; ComponentLink1Description: http://www.yageo.com/documents/recent/PYu-RC0402_51_RoHS_L_6.pdf
R115-R118 R135 R145 = RES_10K_1/16W_1%_0402: as R96 on sheet P07_DDR3 Memory; Category: Resistors; ComponentLink1Description: http://rohmfs.rohm.com/en/products/databook/datasheet/passive/resistor/chip_resistor/mcr_a.pdf; ComponentLink1URL: http://rohmfs.rohm.com/en/products/databook/datasheet/passive/resistor/chip_resistor/mcr_a.pdf; Composition: Thick Film; Features: Automotive AEC-Q200 Qualified; Height: 0.016" (0.40mm); Number of Terminations: 2; Package / Case: 0402 (1005 Metric); Packaging: Digi-Reel®; Pricing 1: 1=0.1, 10=0.019, 25=0.014, 100=0.0078, 250=0.00596, 500=0.00476, 1000=0.0035, 5000=0.00251 (USD); Resistance (Ohms): 10k; RoHS: RoHS Compliant; Size / Dimension: 0.039" L x 0.020" W (1.00mm x 0.50mm); Stock 1: 110842; Supplier 1: Digi-Key; Supplier Device Package: 0402 (1005 Metric); Supplier Part Number 1: RHM10KJDKR-ND; Tolerance: ±5%
R119 = RES_1.5K_1/16W_5%_0402: RES 1.50K OHM 1/16W 1% 0402 SMD; Manufacturer: Yageo; Manufacturer Part Number: RC0402FR-071K5L; Power (Watts): 0.063W, 1/16W; Temperature Coefficient: ±100ppm/°C; Supplier 1: Digi-Key; Supplier Part Number 1: 311-1.50KLRDKR-ND; RoHS: RoHS Compliant; Category: Resistors; Stock 1: 465266; Pricing 1: 1=0.1, 10=0.014, 25=0.0104, 100=0.0063, 250=0.0054, 500=0.00382, 1000=0.0027, 2500=0.00234, 5000=0.00203 (USD); Resistance (Ohms): 1.5k; Composition: Thick Film; Features: -; Tolerance: ±1%; Package / Case: 0402 (1005 Metric); Supplier Device Package: 0402; Size / Dimension: 0.039" L x 0.020" W (1.00mm x 0.50mm); Height: 0.016" (0.40mm); Number of Terminations: 2; Packaging: Digi-Reel®; ComponentLink1URL: http://www.yageo.com/documents/recent/PYu-RC0402_51_RoHS_L_6.pdf; ComponentLink1Description: http://www.yageo.com/documents/recent/PYu-RC0402_51_RoHS_L_6.pdf
R120-R123 = RES_4.7K_0402: RES 49.9 OHM 1/16W 1% 0402 SMD; Manufacturer: Yageo; Manufacturer Part Number: RC0402FR-0749R9L; Power (Watts): 0.063W, 1/16W; Resistance (Ohms): 49.9; Temperature Coefficient: ±100ppm/°C; Category: Resistors; ComponentLink1Description: http://www.yageo.com/documents/recent/PYu-RC0402_51_RoHS_L_6.pdf; ComponentLink1URL: http://www.yageo.com/documents/recent/PYu-RC0402_51_RoHS_L_6.pdf; Composition: Thick Film; Features: -; Height: 0.016" (0.40mm); Number of Terminations: 2; Package / Case: 0402 (1005 Metric); Packaging: Digi-Reel®; Pricing 1: 1=0.1, 10=0.014, 25=0.0104, 100=0.0063, 250=0.0054, 500=0.00382, 1000=0.0027, 2500=0.00234, 5000=0.00203 (USD); RoHS: RoHS Compliant; Size / Dimension: 0.039" L x 0.020" W (1.00mm x 0.50mm); Stock 1: 1338786; Supplier 1: Digi-Key; Supplier Device Package: 0402; Supplier Part Number 1: 311-49.9LRDKR-ND; Tolerance: ±1%
R124 = RES_10K_1/16W_1%_0402: Resistor 10Kohm 1/16W 1% 0402; Manufacturer: Stackpole Electronics Inc; Manufacturer Part Number: RMCF0402FT10R0; Power (Watts): 0.063W, 1/16W; Resistance (Ohms): 10; Temperature Coefficient: ±100ppm/°C; Category: Resistors; ComponentLink1Description: http://www.seielect.com/Catalog/SEI-RMCF_RMCP.pdf; ComponentLink1URL: http://www.seielect.com/Catalog/SEI-RMCF_RMCP.pdf; Composition: Thick Film; Features: -; Height: 0.016" (0.40mm); Number of Terminations: 2; Package / Case: 0402 (1005 Metric); Packaging: Digi-Reel®; Pricing 1: 1=0.04, 10=0.025, 50=0.0138, 100=0.0105, 250=0.0078, 500=0.00576, 1000=0.00384, 2500=0.00324, 5000=0.0027 (USD); RoHS: RoHS Compliant; Size / Dimension: 0.039" L x 0.020" W (1.00mm x 0.50mm); Stock 1: 41540; Supplier 1: Digi-Key; Supplier Device Package: 0402; Supplier Part Number 1: RMCF0402FT10R0DKR-ND; Tolerance: ±1%
R125 R126 R129 R134 R138 = 100-1/10W-1%-0603_4: RES 100 OHM 1/10W 5% 0402 SMD; PART#: Rohm MCR03EZPFX1000; Manufacturer: Panasonic Electronic Components; Manufacturer Part Number: ERJ-2RKF1000X; Resistance (Ohms): 100; Power (Watts): 0.1W, 1/10W; Temperature Coefficient: ±100ppm/°C; RoHS: RoHS; Supplier 1: Digi-Key; Supplier Part Number 1: P100LDKR-ND; Category: Resistors; Stock 1: 2375521; Pricing 1: 1=0.1, 50=0.0242, 100=0.0184, 250=0.01364, 500=0.01008, 1000=0.00672, 5000=0.00473 (USD); Composition: Thick Film; Features: -; Package / Case: 0402 (1005 Metric); Supplier Device Package: 0402; Size / Dimension: 0.039" L x 0.020" W (1.00mm x 0.50mm); Height: 0.016" (0.40mm); Number of Terminations: 2; Packaging: Digi-Reel®; ComponentLink1URL: http://industrial.panasonic.com/www-cgi/jvcr13pz.cgi?E+PZ+3+AOA0002+ERJ2RKF1000X+7+WW; ComponentLink1Description: http://industrial.panasonic.com/www-cgi/jvcr13pz.cgi?E+PZ+3+AOA0002+ERJ2RKF1000X+7+WW
  R134 R138: Wattage: 1/10W; Tolerance: 1%
R127 R128 R131 R133 R139 = RES_100_1/10W_5%_0402: RES 100 OHM 1/10W 5% 0402 SMD; Manufacturer: Panasonic Electronic Components; Manufacturer Part Number: ERJ-2RKF1000X; Resistance (Ohms): 100; Power (Watts): 0.1W, 1/10W; Temperature Coefficient: ±100ppm/°C; Supplier 1: Digi-Key; Supplier Part Number 1: P100LDKR-ND; RoHS: RoHS Compliant; Category: Resistors; Stock 1: 2375521; Pricing 1: 1=0.1, 50=0.0242, 100=0.0184, 250=0.01364, 500=0.01008, 1000=0.00672, 5000=0.00473 (USD); Composition: Thick Film; Features: -; Tolerance: ±1%; Package / Case: 0402 (1005 Metric); Supplier Device Package: 0402; Size / Dimension: 0.039" L x 0.020" W (1.00mm x 0.50mm); Height: 0.016" (0.40mm); Number of Terminations: 2; Packaging: Digi-Reel®; ComponentLink1URL: http://industrial.panasonic.com/www-cgi/jvcr13pz.cgi?E+PZ+3+AOA0002+ERJ2RKF1000X+7+WW; ComponentLink1Description: http://industrial.panasonic.com/www-cgi/jvcr13pz.cgi?E+PZ+3+AOA0002+ERJ2RKF1000X+7+WW
R130 R132 = RES_470_1/10W_5%_0402: RES 470 OHM 1/10W 5% 0402 SMD; Manufacturer: Panasonic Electronic Components; Manufacturer Part Number: ERJ-2GEJ471X; Resistance (Ohms): 470; Power (Watts): 0.1W, 1/10W; Temperature Coefficient: ±200ppm/°C; Supplier 1: Digi-Key; Supplier Part Number 1: P470JDKR-ND; RoHS: RoHS Compliant; Category: Resistors; Stock 1: 563344; Pricing 1: 1=0.1, 50=0.0172, 100=0.0131, 250=0.00976, 500=0.0072, 1000=0.0048, 5000=0.00338 (USD); Composition: Thick Film; Features: -; Tolerance: ±5%; Package / Case: 0402 (1005 Metric); Supplier Device Package: 0402; Size / Dimension: 0.039" L x 0.020" W (1.00mm x 0.50mm); Height: 0.016" (0.40mm); Number of Terminations: 2; Packaging: Digi-Reel®; ComponentLink1URL: http://industrial.panasonic.com/www-cgi/jvcr13pz.cgi?E+PZ+3+AOA0001+ERJ2GEJ471X+7+WW; ComponentLink1Description: http://industrial.panasonic.com/www-cgi/jvcr13pz.cgi?E+PZ+3+AOA0001+ERJ2GEJ471X+7+WW
R136 = RES_0.1_0805: RES .10 OHM 1/8W 5% 0805; Manufacturer: CTS Resistor Products; Manufacturer Part Number: 73L3R10J; Resistance (Ohms): 0.1; Power (Watts): 0.125W, 1/8W; Temperature Coefficient: ±200ppm/°C; Supplier 1: Digi-Key; Supplier Part Number 1: 73L3R10JDKR-ND; RoHS: RoHS Compliant; Category: Resistors; Stock 1: 37057; Pricing 1: 1=0.1, 10=0.066, 100=0.0267, 250=0.0204, 500=0.01632, 1000=0.01201 (USD); Composition: Thick Film; Features: Current Sense; Tolerance: ±5%; Package / Case: 0805 (2012 Metric); Supplier Device Package: 0805; Size / Dimension: 0.079" L x 0.049" W (2.00mm x 1.25mm); Height: 0.026" (0.65mm); Number of Terminations: 2; Packaging: Digi-Reel®; ComponentLink1URL: http://www.ctscorp.com/components/Datasheets/008-0337-0.pdf; ComponentLink1Description: http://www.ctscorp.com/components/Datasheets/008-0337-0.pdf
R137 R140 R142 = RES_0_1/16W_1%_0402: RES 0.0 OHM 1/16W 0402 SMD; Manufacturer: Yageo; Manufacturer Part Number: RC0402JR-070RL; Power (Watts): 0.063W, 1/16W; Resistance (Ohms): 0.0; Tolerance: Jumper; Category: Resistors; ComponentLink1Description: http://www.yageo.com/documents/recent/PYu-RC0402_51_RoHS_L_6.pdf; ComponentLink1URL: http://www.yageo.com/documents/recent/PYu-RC0402_51_RoHS_L_6.pdf; Composition: Thick Film; Features: -; Height: 0.016" (0.40mm); Number of Terminations: 2; Package / Case: 0402 (1005 Metric); Packaging: Digi-Reel®; Pricing 1: 1=0.1, 10=0.012, 25=0.0092, 100=0.0055, 250=0.00476, 500=0.00336, 1000=0.00237, 2500=0.00206, 5000=0.00178 (USD); RoHS: RoHS Compliant; Size / Dimension: 0.039" L x 0.020" W (1.00mm x 0.50mm); Stock 1: 4904429; Supplier 1: Digi-Key; Supplier Device Package: 0402; Supplier Part Number 1: 311-0.0JRDKR-ND; Temperature Coefficient: -
R141 = RES_1M_1/16W_1%_0402: RES 1M OHM 1/16W 1% 0402 SMD; Manufacturer: Stackpole Electronics Inc; Manufacturer Part Number: RMCF0402FT1M00; Power (Watts): 0.063W, 1/16W; Temperature Coefficient: ±100ppm/°C; Category: Resistors; ComponentLink1Description: http://www.seielect.com/Catalog/SEI-RMCF_RMCP.pdf; ComponentLink1URL: http://www.seielect.com/Catalog/SEI-RMCF_RMCP.pdf; Composition: Thick Film; Features: -; Height: 0.016" (0.40mm); Number of Terminations: 2; Package / Case: 0402 (1005 Metric); Packaging: Digi-Reel®; Pricing 1: 1=0.04, 10=0.025, 50=0.0138, 100=0.0105, 250=0.0078, 500=0.00576, 1000=0.00384, 2500=0.00324, 5000=0.0027 (USD); Resistance (Ohms): 1M; RoHS: RoHS Compliant; Size / Dimension: 0.039" L x 0.020" W (1.00mm x 0.50mm); Stock 1: 175650; Supplier 1: Digi-Key; Supplier Device Package: 0402; Supplier Part Number 1: RMCF0402FT1M00DKR-ND; Tolerance: ±1%
R143 = RES_10K_1/16W_1%_0402: RES 10 OHM 1/16W 1% 0402 SMD; Manufacturer: Stackpole Electronics Inc; Manufacturer Part Number: RMCF0402FT10R0; Resistance (Ohms): 10; Power (Watts): 0.063W, 1/16W; Temperature Coefficient: ±100ppm/°C; Supplier 1: Digi-Key; Supplier Part Number 1: RMCF0402FT10R0DKR-ND; RoHS: RoHS Compliant; Category: Resistors; Stock 1: 41540; Pricing 1: 1=0.04, 10=0.025, 50=0.0138, 100=0.0105, 250=0.0078, 500=0.00576, 1000=0.00384, 2500=0.00324, 5000=0.0027 (USD); Composition: Thick Film; Features: -; Tolerance: ±1%; Package / Case: 0402 (1005 Metric); Supplier Device Package: 0402; Size / Dimension: 0.039" L x 0.020" W (1.00mm x 0.50mm); Height: 0.016" (0.40mm); Number of Terminations: 2; Packaging: Digi-Reel®; ComponentLink1URL: http://www.seielect.com/Catalog/SEI-RMCF_RMCP.pdf; ComponentLink1Description: http://www.seielect.com/Catalog/SEI-RMCF_RMCP.pdf
R144 = RES_12.1K_1/16W_1%_0402: RES 12.1K OHM 1/16W 1% 0402 SMD; Manufacturer: Yageo; Manufacturer Part Number: RC0402FR-0712K1L; Power (Watts): 0.063W, 1/16W; Temperature Coefficient: ±100ppm/°C; Category: Resistors; ComponentLink1Description: http://www.yageo.com/documents/recent/PYu-RC0402_51_RoHS_L_6.pdf; ComponentLink1URL: http://www.yageo.com/documents/recent/PYu-RC0402_51_RoHS_L_6.pdf; Composition: Thick Film; Features: -; Height: 0.016" (0.40mm); Number of Terminations: 2; Package / Case: 0402 (1005 Metric); Packaging: Digi-Reel®; Pricing 1: 1=0.1, 10=0.014, 25=0.0104, 100=0.0063, 250=0.0054, 500=0.00382, 1000=0.0027, 2500=0.00234, 5000=0.00203 (USD); Resistance (Ohms): 12.1k; RoHS: RoHS Compliant; Size / Dimension: 0.039" L x 0.020" W (1.00mm x 0.50mm); Stock 1: 320170; Supplier 1: Digi-Key; Supplier Device Package: 0402; Supplier Part Number 1: 311-12.1KLRDKR-ND; Tolerance: ±1%
U14 = LAN8710 QFN32_1: Ethernet ICs 10/100 Ethernet XCVR w/HPAutoMDIX FlexPwr; PART#: SMSC LAN8710A-EZK; Manufacturer: Microchip Technology; Manufacturer Part Number: LAN8710A-EZK-TR; Data Rate: 125 Mb/s; Number of Transceivers: 1; Standard Supported: 802.3, 802.3u; Supply Voltage - Max: 3.6 V; Supply Voltage - Min: 1.6 V, 3 V; Supplier 1: Mouser; Supplier Part Number 1: 886-LAN8710A-EZK-TR; RoHS: RoHS Compliant; Category: Ethernet ICs; Stock 1: 12109; Pricing 1: 1=1.70, 10=1.47, 25=1.23, 100=1.11, 4000=1.11 (AUD); Package / Case: QFN-32; Packaging: Reel; Product: Ethernet Transceivers; Type: Single Chip; Mounting Style: SMD/SMT; Maximum Operating Temperature: + 85 C; Minimum Operating Temperature: 0 C; Product Category: Ethernet Controllers; RoHS - Mouser: Y; Minimum Order Quantity: 1; Reeling: True; ComponentLink1URL: http://www.smsc.com/media/Downloads_Public/Data_Sheets/8710a.pdf; ComponentLink1Description: http://www.smsc.com/media/Downloads_Public/Data_Sheets/8710a.pdf
Y3 = Suntsu ITEMP 25MHz _0.005% 20pf: Manufacturer: Abracon Corporation; Manufacturer Part Number: ABM3-25.000MHZ-B2-T; Frequency: 25MHz; Frequency Stability: ±50ppm; Frequency Tolerance: ±20ppm; Load Capacitance: 18pF; ESR (Equivalent Series Resistance): 50 Ohm; Operating Mode: Fundamental; Supplier 1: Digi-Key; Supplier Part Number 1: 535-9108-6-ND; RoHS: RoHS Compliant; Category: Crystals and Oscillators; Stock 1: 23589; Pricing 1: 1=1.43, 10=1.235, 50=1.083, 100=0.855, 500=0.722 (USD); Type: MHz Crystal; Operating Temperature: -20°C ~ 70°C; Ratings: -; Mounting Type: Surface Mount; Package / Case: 2-SMD; Size / Dimension: 0.197" L x 0.126" W (5.00mm x 3.20mm); Height: 0.051" (1.30mm); Packaging: Digi-Reel®; ComponentLink1URL: http://www.abracon.com/Resonators/abm3.pdf; ComponentLink1Description: http://www.abracon.com/Resonators/abm3.pdf